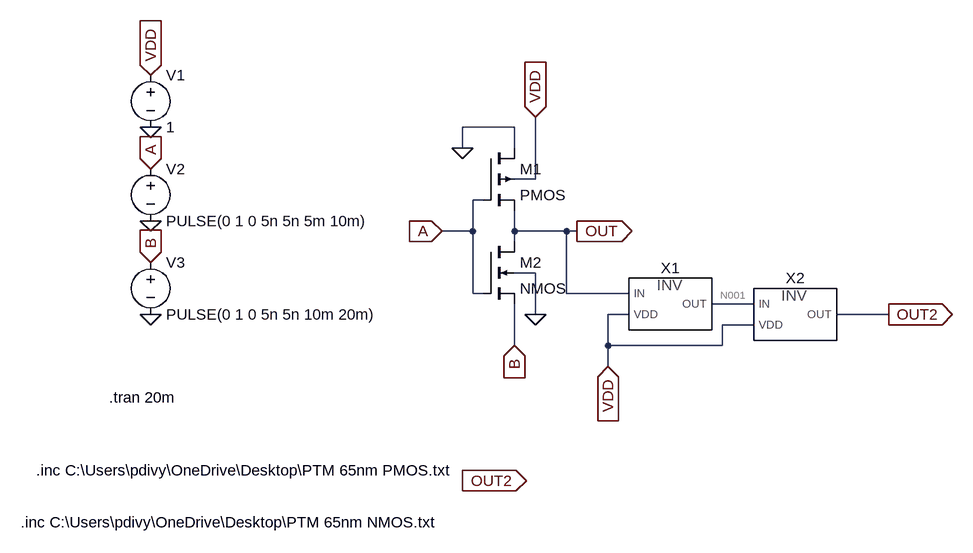
[diagram p0: schematic Draft6.asc]
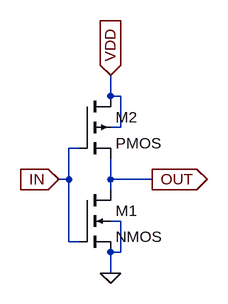
[diagram p1: sub-circuit invcmos.asc]
Draft6.asc, the LTspice schematic file:
Version 4
SHEET 1 892 680
WIRE 192 16 112 16
WIRE 112 48 112 16
WIRE 192 48 192 16
WIRE 224 96 224 0
WIRE 224 96 192 96
WIRE 144 128 128 128
WIRE 128 176 128 128
WIRE 128 176 80 176
WIRE 192 176 192 144
WIRE 272 176 192 176
WIRE 288 176 272 176
WIRE 192 192 192 176
WIRE 224 240 192 240
WIRE 128 272 128 176
WIRE 144 272 128 272
WIRE 272 272 272 176
WIRE 368 272 272 272
WIRE 560 288 496 288
WIRE 224 304 224 240
WIRE 368 304 336 304
WIRE 768 304 688 304
WIRE 560 320 512 320
WIRE 192 352 192 288
WIRE 336 352 336 304
WIRE 512 352 512 320
WIRE 512 352 336 352
WIRE 336 384 336 352
FLAG 192 352 B
IOPIN 192 352 In
FLAG 80 176 A
IOPIN 80 176 In
FLAG 288 176 OUT
IOPIN 288 176 Out
FLAG 224 0 VDD
IOPIN 224 0 In
FLAG 112 48 0
FLAG 224 304 0
FLAG -368 304 0
FLAG -368 160 0
FLAG -368 16 0
FLAG -368 -64 VDD
IOPIN -368 -64 In
FLAG -368 80 A
IOPIN -368 80 In
FLAG -368 224 B
IOPIN -368 224 In
FLAG 336 384 VDD
IOPIN 336 384 In
FLAG 112 560 OUT2
IOPIN 112 560 Out
FLAG 768 304 OUT2
IOPIN 768 304 Out
SYMBOL pmos4 144 48 R0
SYMATTR InstName M1
SYMBOL nmos4 144 192 R0
SYMATTR InstName M2
SYMBOL voltage -368 -80 R0
WINDOW 123 0 0 Left 0
WINDOW 39 0 0 Left 0
SYMATTR InstName V1
SYMATTR Value 1
SYMBOL voltage -368 64 R0
WINDOW 123 0 0 Left 0
WINDOW 39 0 0 Left 0
SYMATTR InstName V2
SYMATTR Value PULSE(0 1 0 5n 5n 5m 10m)
SYMBOL voltage -368 208 R0
WINDOW 123 0 0 Left 0
WINDOW 39 0 0 Left 0
SYMATTR InstName V3
SYMATTR Value PULSE(0 1 0 5n 5n 10m 20m)
SYMBOL InvCMOS 432 288 R0
SYMATTR InstName X1
SYMBOL InvCMOS 624 304 R0
SYMATTR InstName X2
TEXT -432 432 Left 2 !.tran 20m
TEXT -544 544 Left 2 !.inc C:\\Users\\pdivy\\OneDrive\\Desktop\\PTM 65nm PMOS.txt
TEXT -568 624 Left 2 !.inc C:\\Users\\pdivy\\OneDrive\\Desktop\\PTM 65nm NMOS.txt

invcmos.asc, the sub-circuit schematic file:
Version 4
SHEET 1 880 680
WIRE 208 32 208 0
WIRE 224 32 208 32
WIRE 224 80 224 32
WIRE 224 80 208 80
WIRE 160 112 144 112
WIRE 144 160 144 112
WIRE 144 160 128 160
WIRE 208 160 208 128
WIRE 272 160 208 160
WIRE 208 176 208 160
WIRE 224 224 208 224
WIRE 144 256 144 160
WIRE 160 256 144 256
WIRE 224 272 224 224
WIRE 224 272 208 272
WIRE 208 304 208 272
FLAG 208 304 0
FLAG 208 0 VDD
IOPIN 208 0 In
FLAG 128 160 IN
IOPIN 128 160 In
FLAG 272 160 OUT
IOPIN 272 160 Out
SYMBOL nmos4 160 176 R0
SYMATTR InstName M1
SYMATTR Value2 l=65nm w=65nm
SYMBOL pmos4 160 32 R0
SYMATTR InstName M2
SYMATTR Value2 l=65nm w=162.5nm

The netlist it stands for:
* Draft6.asc
M1 0 A OUT VDD PMOS
M2 OUT A B 0 NMOS
V1 VDD 0 1
V2 A 0 PULSE(0 1 0 5n 5n 5m 10m)
V3 B 0 PULSE(0 1 0 5n 5n 10m 20m)
XX1 OUT VDD N001 invcmos
XX2 N001 VDD OUT2 invcmos

* block symbol definitions
.subckt invcmos IN VDD OUT
M1 OUT IN 0 0 NMOS l=65nm w=65nm
M2 VDD IN OUT VDD PMOS l=65nm w=162.5nm
.ends invcmos

.model NMOS NMOS
.model PMOS PMOS
.lib standard.mos
.tran 20m
.inc C:\Users\pdivy\OneDrive\Desktop\PTM 65nm PMOS.txt
.inc C:\Users\pdivy\OneDrive\Desktop\PTM 65nm NMOS.txt
.backanno
.end

* Results of the author's LTspice run, read from the files saved beside the schematic
* Operating Point, zero values left out:
*   V(out) = 142.2 mV
*   V(vdd) = 1 V
*   V(n001) = 999.5 mV
*   V(out2) = 14.56 µV
*   Id(M1) = -3.251 pA
*   Ib(M1) = 1.887 pA
*   Is(M1) = 1.562 pA
*   Id(M2) = 54.61 pA
*   Ig(M2) = -8.609 pA
*   Is(M2) = -45.84 pA
*   I(V1) = -70.23 nA
*   I(V2) = 8.807 pA
*   I(V3) = 45.84 pA
*   Ix(x1:IN) = -56.17 pA
*   Ix(x1:VDD) = 66.99 nA
*   Ix(x1:OUT) = -597.1 pA
*   Ix(x2:IN) = 597.1 pA
*   Ix(x2:VDD) = 3.23 nA
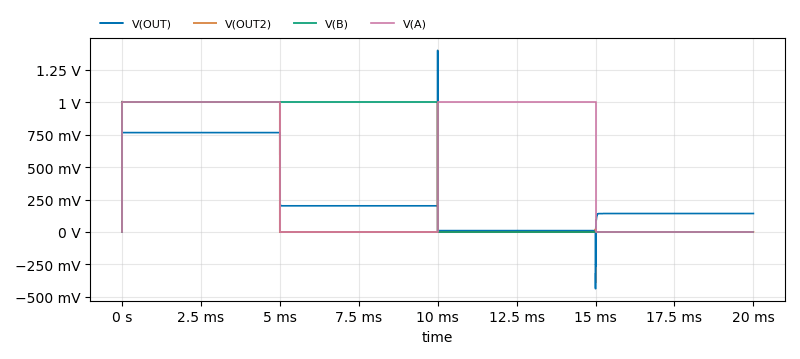
[diagram p2: Transient Analysis of Draft6.asc, plotted from the saved traces]
* Transient Analysis, 1 run:
*   V(OUT): min -437.2 mV, max 1.398 V, average 279.6 mV, rms 401.8 mV, last 142.2 mV
*   V(OUT2): min -1.587 mV, max 1.004 V, average 250.1 mV, rms 500 mV, last 14.56 µV
*   V(B): min 0 V, max 1 V, average 500 mV, rms 707.1 mV, last 0 V
*   V(A): min 0 V, max 1 V, average 500 mV, rms 707.1 mV, last 0 V